# Altium schematic sheet ADC_Power_supply.SchDoc: title
size A2; Author: M.Beldyga; CompanyName: WUT ISE; DrawnBy: M.Beldyga; Organization: WUT ISE; Address1: PW ISE; Address2: Nowowiejska 15/19 00-665 Warsaw; Address3: micbeldyga@gmail.com; SheetNumber: 7; SheetTotal: 8; ModifiedBy: -; CheckedDate: -; Title2: xxx; DivGrp: WUT ISE; Designer: M.Beldyga; ModifiedDate: -; ProjectName: Sensor Box
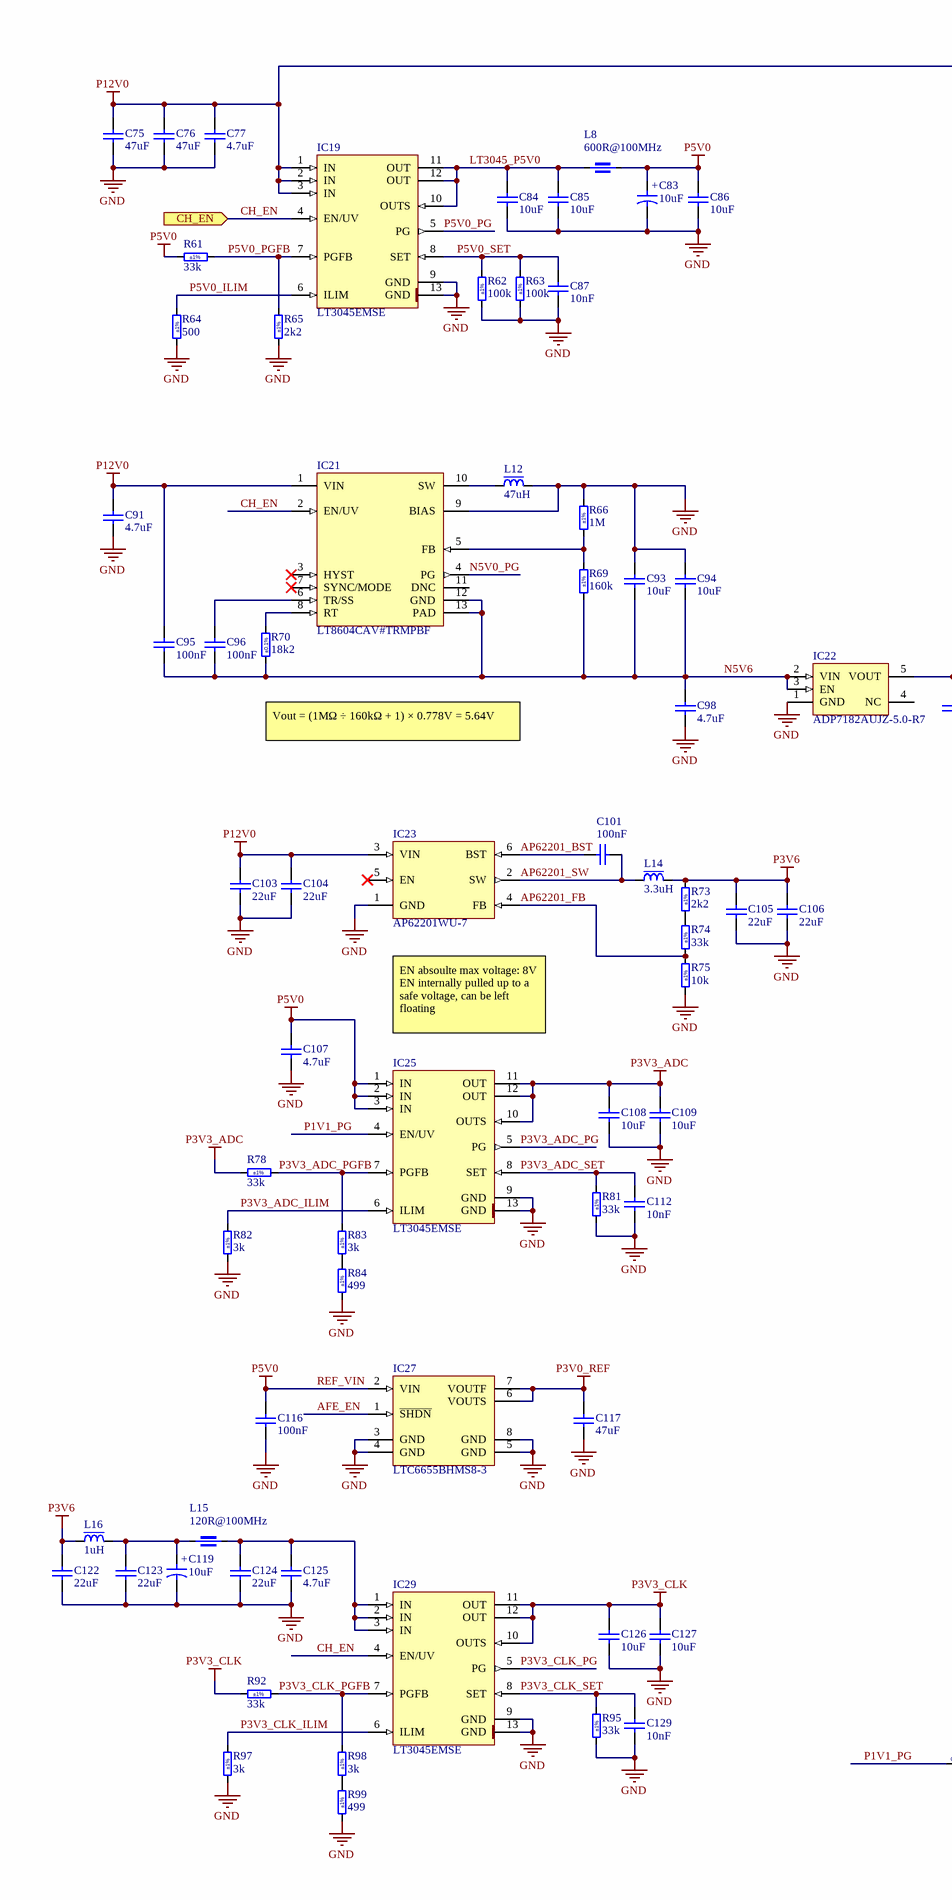
[diagram p0: ADC_Power_supply.SchDoc, left]
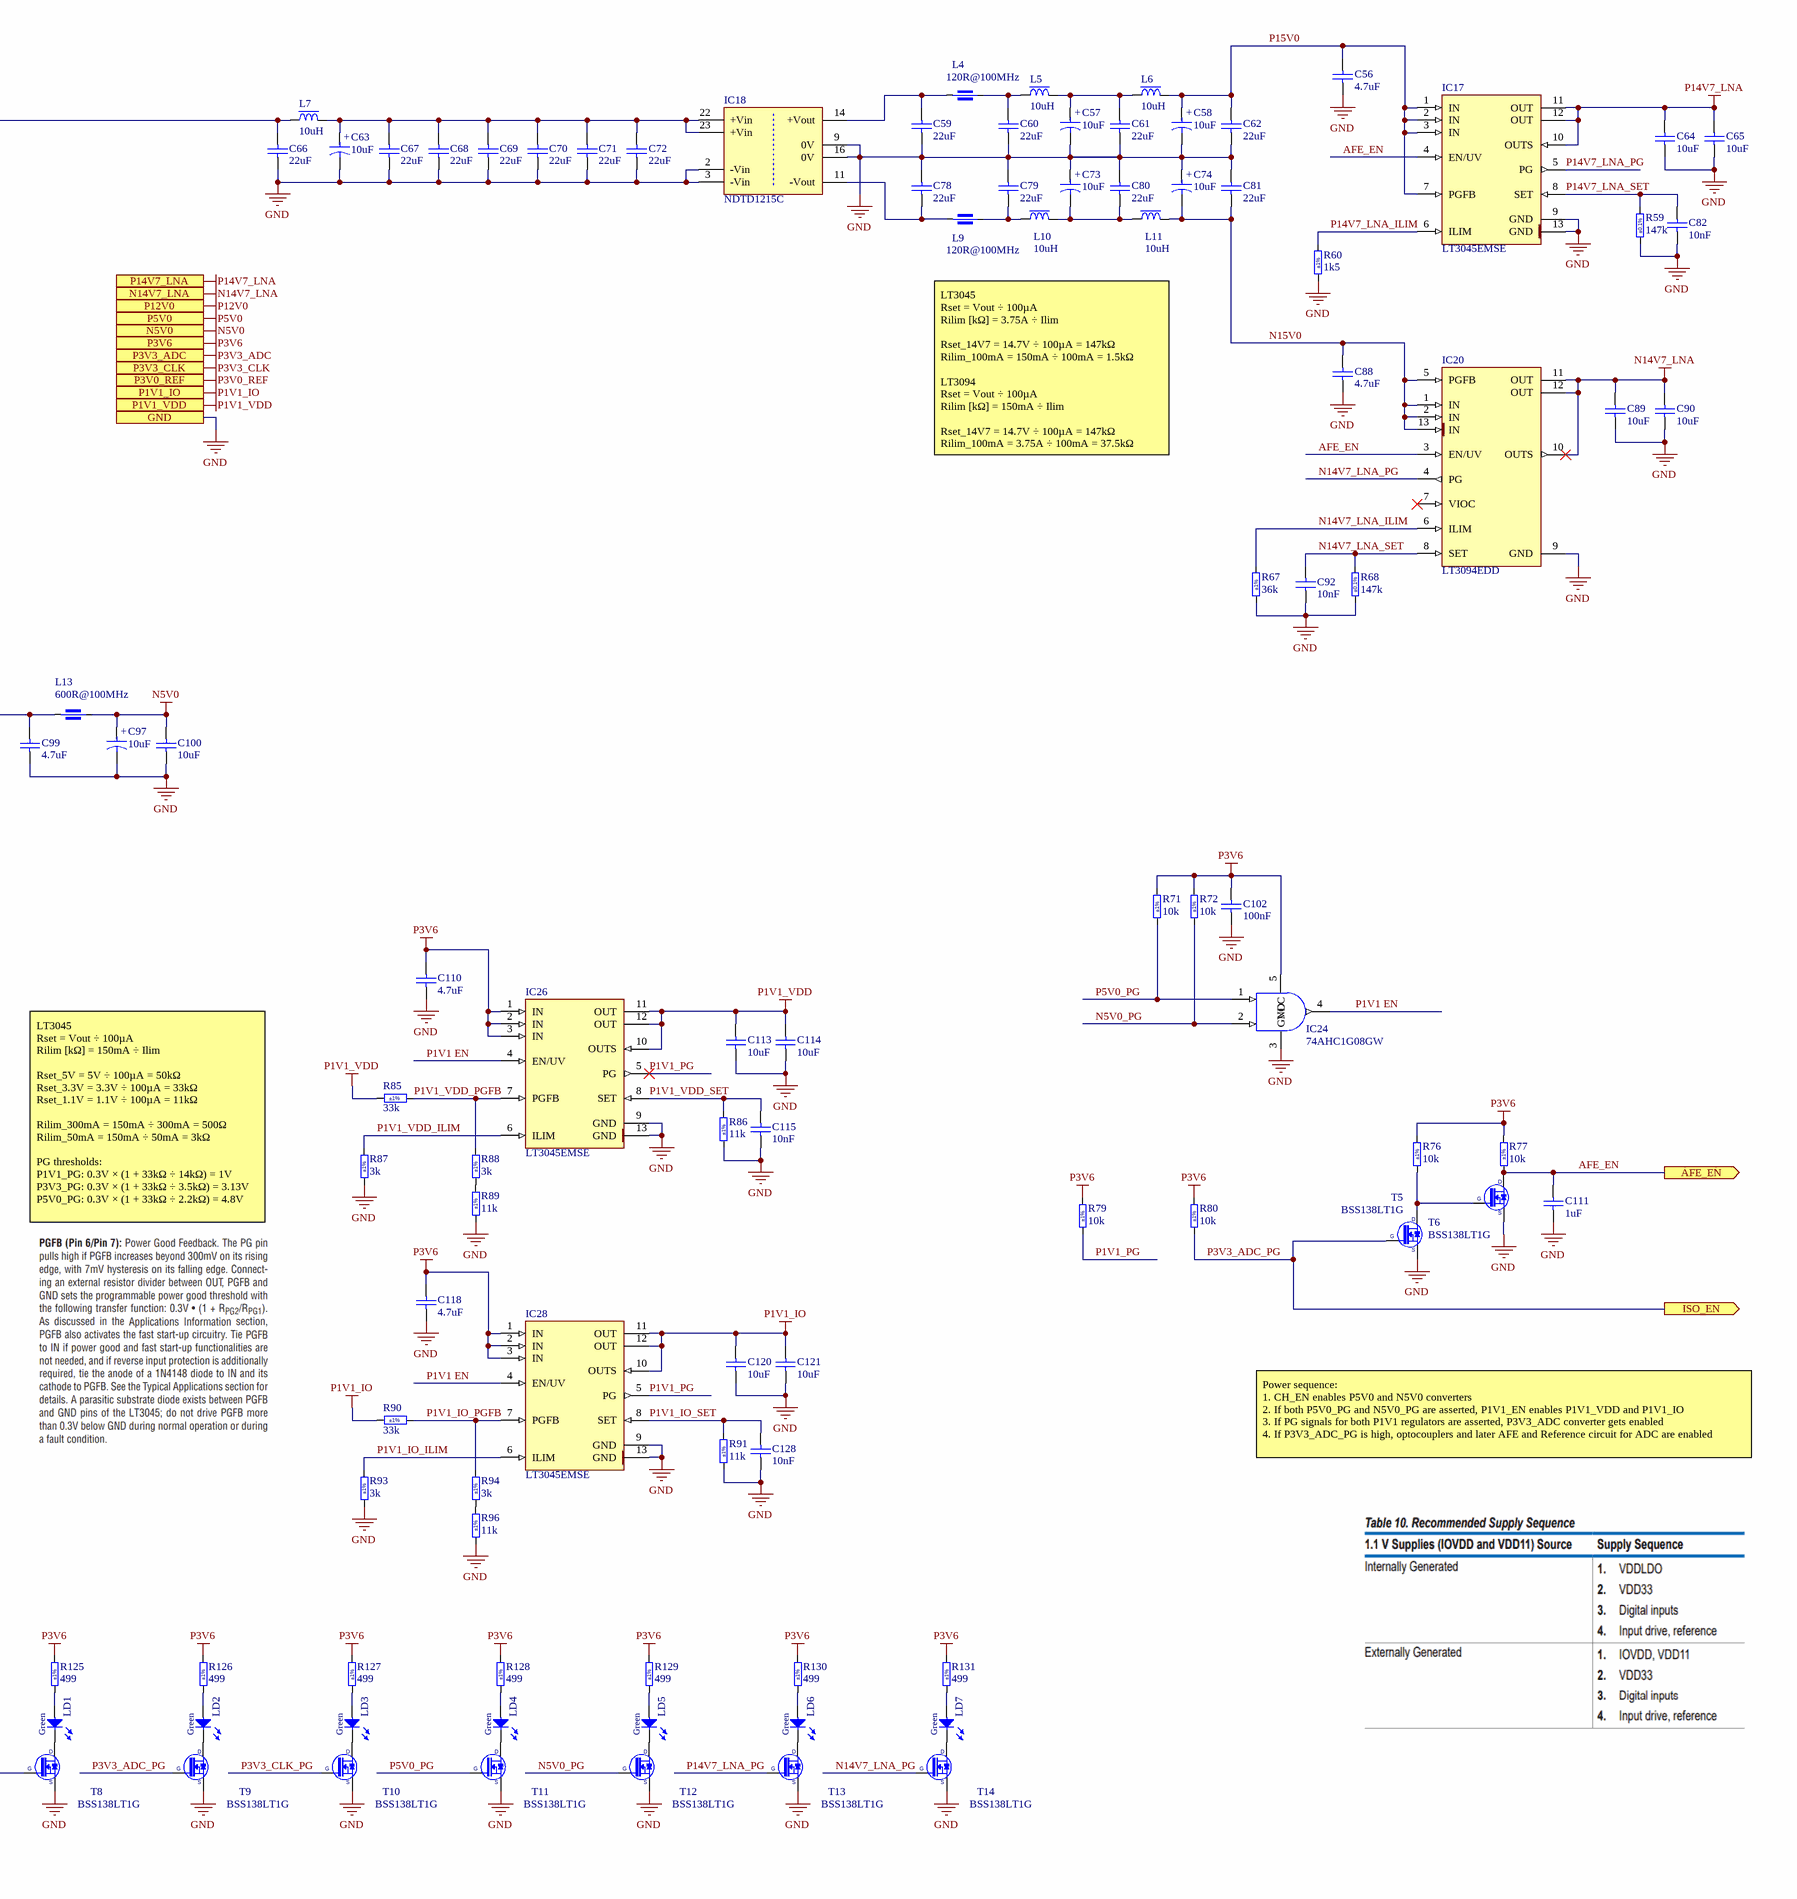
[diagram p1: ADC_Power_supply.SchDoc, right]

## Parts
C56  4.7uF  [CAPC1608X90N]
C57  10uF  [CAPMP3216X180N]
C58  10uF  [CAPMP3216X180N]
C59  22uF  [CAPC2012X135N]
C60  22uF  [CAPC2012X135N]
C61  22uF  [CAPC2012X135N]
C62  22uF  [CAPC2012X135N]
C63  10uF  [CAPMP3216X180N]
C64  10uF  [CAPC2012X95N]
C65  10uF  [CAPC2012X95N]
C66  22uF  [CAPC2012X135N]
C67  22uF  [CAPC2012X135N]
C68  22uF  [CAPC2012X135N]
C69  22uF  [CAPC2012X135N]
C70  22uF  [CAPC2012X135N]
C71  22uF  [CAPC2012X135N]
C72  22uF  [CAPC2012X135N]
C73  10uF  [CAPMP3216X180N]
C74  10uF  [CAPMP3216X180N]
C75  47uF  [CAPC3216X180N]
C76  47uF  [CAPC3216X180N]
C77  4.7uF  [CAPC1608X90N]
C78  22uF  [CAPC2012X135N]
C79  22uF  [CAPC2012X135N]
C80  22uF  [CAPC2012X135N]
C81  22uF  [CAPC2012X135N]
C82  10nF  [CAPC1005X55N]
C83  10uF  [CAPMP3216X180N]
C84  10uF  [CAPC2012X95N]
C85  10uF  [CAPC2012X95N]
C86  10uF  [CAPC2012X95N]
C87  10nF  [CAPC1005X55N]
C88  4.7uF  [CAPC1608X90N]
C89  10uF  [CAPC2012X95N]
C90  10uF  [CAPC2012X95N]
C91  4.7uF  [CAPC1608X90N]
C92  10nF  [CAPC1005X55N]
C93  10uF  [CAPC2012X95N]
C94  10uF  [CAPC2012X95N]
C95  100nF  [CAPC1005X55N]
C96  100nF  [CAPC1005X55N]
C97  10uF  [CAPMP3216X180N]
C98  4.7uF  [CAPC1608X90N]
C99  4.7uF  [CAPC1608X90N]
C100  10uF  [CAPC2012X95N]
C101  100nF  [CAPC1005X55N]
C102  100nF  [CAPC1005X55N]
C103  22uF  [CAPC2012X135N]
C104  22uF  [CAPC2012X135N]
C105  22uF  [CAPC2012X135N]
C106  22uF  [CAPC2012X135N]
C107  4.7uF  [CAPC1608X90N]
C108  10uF  [CAPC2012X95N]
C109  10uF  [CAPC2012X95N]
C110  4.7uF  [CAPC1608X90N]
C111  1uF  [CAPC1608X87N]
C112  10nF  [CAPC1005X55N]
C113  10uF  [CAPC2012X95N]
C114  10uF  [CAPC2012X95N]
C115  10nF  [CAPC1005X55N]
C116  100nF  [CAPC1005X55N]
C117  47uF  [CAPC2012X140N]
C118  4.7uF  [CAPC1608X90N]
C119  10uF  [CAPMP3216X180N]
C120  10uF  [CAPC2012X95N]
C121  10uF  [CAPC2012X95N]
C122  22uF  [CAPC2012X135N]
C123  22uF  [CAPC2012X135N]
C124  22uF  [CAPC2012X135N]
C125  4.7uF  [CAPC1608X90N]
C126  10uF  [CAPC2012X95N]
C127  10uF  [CAPC2012X95N]
C128  10nF  [CAPC1005X55N]
C129  10nF  [CAPC1005X55N]
IC17  LT3045EMSE  [SOP65P490X110-13N-R175X294]
IC18  NDTD1215C  [DCDC_MURATA_NDTD]
IC19  LT3045EMSE  [SOP65P490X110-13N-R175X294]
IC20  LT3094EDD  [SON45P300X300X80-13N-R175X248]
IC21  LT8604CAV#TRMPBF  [QFN50P200X200X83_HS-13N]
IC22  ADP7182AUJZ-5.0-R7  [SOT95P280X90-5N]
IC23  AP62201WU-7  [SOT95P280X100-6N]
IC24  74AHC1G08GW  [SOT65P212X110-5N]
IC25  LT3045EMSE  [SOP65P490X110-13N-R175X294]
IC26  LT3045EMSE  [SOP65P490X110-13N-R175X294]
IC27  LTC6655BHMS8-3  [SOP65P490X110-8N]
IC28  LT3045EMSE  [SOP65P490X110-13N-R175X294]
IC29  LT3045EMSE  [SOP65P490X110-13N-R175X294]
L4  120R@100MHz  [INDC1608X95N]
L5  10uH  [IND_MURATA-PS_8400]
L6  10uH  [IND_MURATA-PS_8400]
L7  10uH  [IND_MURATA-PS_8400]
L8  600R@100MHz  [INDC1608X95N]
L9  120R@100MHz  [INDC1608X95N]
L10  10uH  [IND_MURATA-PS_8400]
L11  10uH  [IND_MURATA-PS_8400]
L12  47uH  [IND_NIC_NPIS64D]
L13  600R@100MHz  [INDC1608X95N]
L14  3.3uH  [IND_WURTH_WE-TPC_4828]
L15  120R@100MHz  [INDC1608X65N]
L16  1uH  [IND_COILCRAFT_PFL3215]
LD1  Green  [LED_AVAGO_HSME-C120]
LD2  Green  [LED_AVAGO_HSME-C120]
LD3  Green  [LED_AVAGO_HSME-C120]
LD4  Green  [LED_AVAGO_HSME-C120]
LD5  Green  [LED_AVAGO_HSME-C120]
LD6  Green  [LED_AVAGO_HSME-C120]
LD7  Green  [LED_AVAGO_HSME-C120]
R59  147k  Tolerance: ±0.1%  [RESC1608X55N]
R60  1k5  Tolerance: ±1%  [RESC1005X40N]
R61  33k  Tolerance: ±1%  [RESC1005X40N]
R62  100k  Tolerance: ±1%  [RESC1005X40N]
R63  100k  Tolerance: ±1%  [RESC1005X40N]
R64  500  Tolerance: ±1%  [RESC1608X55N]
R65  2k2  Tolerance: ±1%  [RESC1005X40N]
R66  1M  Tolerance: ±1%  [RESC1005X40N]
R67  36k  Tolerance: ±1%  [RESC1005X40N]
R68  147k  Tolerance: ±0.1%  [RESC1608X55N]
R69  160k  Tolerance: ±1%  [RESC1005X40N]
R70  18k2  Tolerance: ±0.1%  [RESC1608X55N]
R71  10k  Tolerance: ±1%  [RESC1005X40N]
R72  10k  Tolerance: ±1%  [RESC1005X40N]
R73  2k2  Tolerance: ±1%  [RESC1005X40N]
R74  33k  Tolerance: ±1%  [RESC1005X40N]
R75  10k  Tolerance: ±1%  [RESC1005X40N]
R76  10k  Tolerance: ±1%  [RESC1005X40N]
R77  10k  Tolerance: ±1%  [RESC1005X40N]
R78  33k  Tolerance: ±1%  [RESC1005X40N]
R79  10k  Tolerance: ±1%  [RESC1005X40N]
R80  10k  Tolerance: ±1%  [RESC1005X40N]
R81  33k  Tolerance: ±1%  [RESC1005X40N]
R82  3k  Tolerance: ±1%  [RESC1005X40N]
R83  3k  Tolerance: ±1%  [RESC1005X40N]
R84  499  Tolerance: ±1%  [RESC1005X40N]
R85  33k  Tolerance: ±1%  [RESC1005X40N]
R86  11k  Tolerance: ±1%  [RESC1005X40N]
R87  3k  Tolerance: ±1%  [RESC1005X40N]
R88  3k  Tolerance: ±1%  [RESC1005X40N]
R89  11k  Tolerance: ±1%  [RESC1005X40N]
R90  33k  Tolerance: ±1%  [RESC1005X40N]
R91  11k  Tolerance: ±1%  [RESC1005X40N]
R92  33k  Tolerance: ±1%  [RESC1005X40N]
R93  3k  Tolerance: ±1%  [RESC1005X40N]
R94  3k  Tolerance: ±1%  [RESC1005X40N]
R95  33k  Tolerance: ±1%  [RESC1005X40N]
R96  11k  Tolerance: ±1%  [RESC1005X40N]
R97  3k  Tolerance: ±1%  [RESC1005X40N]
R98  3k  Tolerance: ±1%  [RESC1005X40N]
R99  499  Tolerance: ±1%  [RESC1005X40N]
R125  499  Tolerance: ±1%  [RESC1005X40N]
R126  499  Tolerance: ±1%  [RESC1005X40N]
R127  499  Tolerance: ±1%  [RESC1005X40N]
R128  499  Tolerance: ±1%  [RESC1005X40N]
R129  499  Tolerance: ±1%  [RESC1005X40N]
R130  499  Tolerance: ±1%  [RESC1005X40N]
R131  499  Tolerance: ±1%  [RESC1005X40N]
T5  BSS138LT1G  [SOT95P240X110-3N]
T6  BSS138LT1G  [SOT95P240X110-3N]
T8  BSS138LT1G  [SOT95P240X110-3N]
T9  BSS138LT1G  [SOT95P240X110-3N]
T10  BSS138LT1G  [SOT95P240X110-3N]
T11  BSS138LT1G  [SOT95P240X110-3N]
T12  BSS138LT1G  [SOT95P240X110-3N]
T13  BSS138LT1G  [SOT95P240X110-3N]
T14  BSS138LT1G  [SOT95P240X110-3N]

## Ports
AFE_EN (out), CH_EN (in), GND, ISO_EN (out), N5V0, N14V7_LNA, P1V1_IO, P1V1_VDD, P3V0_REF, P3V3_ADC, P3V3_CLK, P3V6, P5V0, P12V0, P14V7_LNA

## Nets
GND: C56.1 C57.2 C58.2 C59.1 C60.1 C61.1 C62.1 C63.2 C64.1 C65.1 C66.1 C67.1 C68.1 C69.1 C70.1 C71.1 C72.1 C73.1 C74.1 C75.1 C76.1 C77.1 C78.2 C79.2 C80.2 C81.2 C82.1 C83.2 C84.1 C85.1 C86.1 C87.1 C88.1 C89.1 C90.1 C91.1 C92.1 C93.2 C94.2 C97.2 C98.1 C99.1 C100.1 C102.1 C103.1 C104.1 C105.1 C106.1 C107.1 C108.1 C109.1 C110.1 C111.1 C112.1 C113.1 C114.1 C115.1 C116.1 C117.1 C118.1 C119.2 C120.1 C121.1 C122.1 C123.1 C124.1 C125.1 C126.1 C127.1 C128.1 C129.1 IC17.9(GND) IC17.13(GND) IC18.2(-Vin) IC18.3(-Vin) IC18.9(0V) IC18.16(0V) IC19.9(GND) IC19.13(GND) IC20.9(GND) IC21.9(BIAS) IC22.1(GND) IC23.1(GND) IC24.3(GND) IC25.9(GND) IC25.13(GND) IC26.9(GND) IC26.13(GND) IC27.3(GND) IC27.4(GND) IC27.5(GND) IC27.8(GND) IC28.9(GND) IC28.13(GND) IC29.9(GND) IC29.13(GND) L12.2 R59.1 R60.1 R62.1 R63.1 R64.1 R65.1 R66.2 R67.1 R68.1 R75.1 R81.1 R82.1 R84.1 R86.1 R87.1 R89.1 R91.1 R93.1 R95.1 R96.1 R97.1 R99.1 T5.2(S) T6.2(S) T8.2(S) T9.2(S) T10.2(S) T11.2(S) T12.2(S) T13.2(S) T14.2(S) ; port GND
N5V0: C97.1 C100.2 L13.2 ; port N5V0
N14V7_LNA: C89.2 C90.2 IC20.10(OUTS) IC20.11(OUT) IC20.12(OUT) ; port N14V7_LNA
P1V1_IO: C120.2 C121.2 IC28.10(OUTS) IC28.11(OUT) IC28.12(OUT) R90.2 ; port P1V1_IO
P1V1_VDD: C113.2 C114.2 IC26.10(OUTS) IC26.11(OUT) IC26.12(OUT) R85.2 ; port P1V1_VDD
P3V0_REF: C117.2 IC27.6(VOUTS) IC27.7(VOUTF) ; port P3V0_REF
P3V3_ADC: C108.2 C109.2 IC25.10(OUTS) IC25.11(OUT) IC25.12(OUT) R78.2 ; port P3V3_ADC
P3V3_CLK: C126.2 C127.2 IC29.10(OUTS) IC29.11(OUT) IC29.12(OUT) R92.2 ; port P3V3_CLK
P3V6: C102.2 C105.2 C106.2 C110.2 C118.2 C122.2 IC24.5(VCC) IC26.1(IN) IC26.2(IN) IC26.3(IN) IC28.1(IN) IC28.2(IN) IC28.3(IN) L14.2 L16.1 R71.2 R72.2 R73.2 R76.2 R77.2 R79.2 R80.2 R125.2 R126.2 R127.2 R128.2 R129.2 R130.2 R131.2 ; port P3V6
P12V0: C66.2 C75.2 C76.2 C77.2 C91.2 C95.2 C103.2 C104.2 IC19.1(IN) IC19.2(IN) IC19.3(IN) IC21.1(VIN) IC23.3(VIN) L7.1 ; port P12V0
P14V7_LNA: C64.2 C65.2 IC17.10(OUTS) IC17.11(OUT) IC17.12(OUT) ; port P14V7_LNA
REF_VIN: C83.1 C86.2 C107.2 C116.2 IC25.1(IN) IC25.2(IN) IC25.3(IN) IC27.2(VIN) L8.2 R61.2 ; port P5V0  [also labelled P5V0]
AFE_EN: C111.2 IC17.4(EN/UV) IC20.3(EN/UV) IC27.1(~{SHDN}) R77.1 T6.3(D) ; port AFE_EN
AP62201_BST: C101.1 IC23.6(BST)
AP62201_FB: IC23.4(FB) R74.1 R75.2
AP62201_SW: C101.2 IC23.2(SW) L14.1
CH_EN: IC19.4(EN/UV) IC21.2(EN/UV) IC29.4(EN/UV) ; port CH_EN
LT3045_P5V0: C84.2 C85.2 IC19.10(OUTS) IC19.11(OUT) IC19.12(OUT) L8.1
N5V0_PG: IC21.4(PG) IC24.2(B) R72.1 T12.1(G)
N5V6: C93.1 C94.1 C95.1 C96.1 C98.2 IC21.12(GND) IC21.13(PAD) IC22.2(VIN) IC22.3(EN) R69.1 R70.1
N14V7_LNA_ILIM: IC20.6(ILIM) R67.2
N14V7_LNA_PG: IC20.4(PG) T14.1(G)
N14V7_LNA_SET: C92.2 IC20.8(SET) R68.2
N15V0: C74.2 C81.1 C88.2 IC20.1(IN) IC20.2(IN) IC20.5(PGFB) IC20.13(IN) L11.2
P1V1 EN: IC24.4(Y) IC26.4(EN/UV) IC28.4(EN/UV)
P1V1_IO_ILIM: IC28.6(ILIM) R93.2
P1V1_IO_PGFB: IC28.7(PGFB) R90.1 R94.2
P1V1_IO_SET: C128.2 IC28.8(SET) R91.2
P1V1_PG: IC25.4(EN/UV) IC26.5(PG) IC28.5(PG) R79.1 T8.1(G)
P1V1_VDD_ILIM: IC26.6(ILIM) R87.2
P1V1_VDD_PGFB: IC26.7(PGFB) R85.1 R88.2
P1V1_VDD_SET: C115.2 IC26.8(SET) R86.2
P3V3_ADC_ILIM: IC25.6(ILIM) R82.2
P3V3_ADC_PG: IC25.5(PG) R80.1 T5.1(G) T9.1(G) ; port ISO_EN
P3V3_ADC_PGFB: IC25.7(PGFB) R78.1 R83.2
P3V3_ADC_SET: C112.2 IC25.8(SET) R81.2
P3V3_CLK_ILIM: IC29.6(ILIM) R97.2
P3V3_CLK_PG: IC29.5(PG) T10.1(G)
P3V3_CLK_PGFB: IC29.7(PGFB) R92.1 R98.2
P3V3_CLK_SET: C129.2 IC29.8(SET) R95.2
P5V0_ILIM: IC19.6(ILIM) R64.2
P5V0_PG: IC19.5(PG) IC24.1(A) R71.1 T11.1(G)
P5V0_PGFB: IC19.7(PGFB) R61.1 R65.2
P5V0_SET: C87.2 IC19.8(SET) R62.2 R63.2
P14V7_LNA_ILIM: IC17.6(ILIM) R60.2
P14V7_LNA_PG: IC17.5(PG) T13.1(G)
P14V7_LNA_SET: C82.2 IC17.8(SET) R59.2
P15V0: C56.2 C58.1 C62.2 IC17.1(IN) IC17.2(IN) IC17.3(IN) IC17.7(PGFB) L6.2
NetC57_1: C57.1 C61.2 L5.2 L6.1
NetC59_2: C59.2 IC18.14(+Vout) L4.1
NetC60_2: C60.2 L4.2 L5.1
NetC63_1: C63.1 C67.2 C68.2 C69.2 C70.2 C71.2 C72.2 IC18.22(+Vin) IC18.23(+Vin) L7.2
NetC73_2: C73.2 C80.1 L10.2 L11.1
NetC78_1: C78.1 IC18.11(-Vout) L9.1
NetC79_1: C79.1 L9.2 L10.1
NetC96_2: C96.2 IC21.6(TR/SS)
NetC99_2: C99.2 IC22.5(VOUT) L13.1
NetC119_1: C119.1 C123.2 L15.1 L16.2
NetC124_2: C124.2 C125.2 IC29.1(IN) IC29.2(IN) IC29.3(IN) L15.2
NetIC21_5: IC21.5(FB) R66.1 R69.2
NetIC21_8: IC21.8(RT) R70.2
NetIC21_10: IC21.10(SW) L12.1
NetLD1_1: LD1.1(C) T8.3(D)
NetLD1_2: LD1.2(A) R125.1
NetLD2_1: LD2.1(C) T9.3(D)
NetLD2_2: LD2.2(A) R126.1
NetLD3_1: LD3.1(C) T10.3(D)
NetLD3_2: LD3.2(A) R127.1
NetLD4_1: LD4.1(C) T11.3(D)
NetLD4_2: LD4.2(A) R128.1
NetLD5_1: LD5.1(C) T12.3(D)
NetLD5_2: LD5.2(A) R129.1
NetLD6_1: LD6.1(C) T13.3(D)
NetLD6_2: LD6.2(A) R130.1
NetLD7_1: LD7.1(C) T14.3(D)
NetLD7_2: LD7.2(A) R131.1
NetR73_1: R73.1 R74.2
NetR76_1: R76.1 T5.3(D) T6.1(G)
NetR83_1: R83.1 R84.2
NetR88_1: R88.1 R89.2
NetR94_1: R94.1 R96.2
NetR98_1: R98.1 R99.2

Not connected (* = marked no-connect by the designer): IC20 7(VIOC)*; IC21 3(HYST)* 7(SYNC/MODE)* 11(DNC); IC22 4(NC); IC23 5(EN)*

## Notes on the sheet
- LT3045
  Rset = Vout ÷ 100µA
  Rilim [kΩ] = 3.75A ÷ Ilim
  Rset_14V7 = 14.7V ÷ 100µA = 147kΩ
  Rilim_100mA = 150mA ÷ 100mA = 1.5kΩ
  LT3094
  Rset = Vout ÷ 100µA
  Rilim [kΩ] = 150mA ÷ Ilim
  Rset_14V7 = 14.7V ÷ 100µA = 147kΩ
  Rilim_100mA = 3.75A ÷ 100mA = 37.5kΩ
- Vout = (1MΩ ÷ 160kΩ + 1) × 0.778V = 5.64V
- EN absoulte max voltage: 8V
  EN internally pulled up to a safe voltage, can be left floating
- LT3045
  Rset = Vout ÷ 100µA
  Rilim [kΩ] = 150mA ÷ Ilim
  Rset_5V = 5V ÷ 100µA = 50kΩ
  Rset_3.3V = 3.3V ÷ 100µA = 33kΩ
  Rset_1.1V = 1.1V ÷ 100µA = 11kΩ
  Rilim_300mA = 150mA ÷ 300mA = 500Ω
  Rilim_50mA = 150mA ÷ 50mA = 3kΩ
  PG thresholds:
  P1V1_PG: 0.3V × (1 + 33kΩ ÷ 14kΩ) = 1V
  P3V3_PG: 0.3V × (1 + 33kΩ ÷ 3.5kΩ) = 3.13V
  P5V0_PG: 0.3V × (1 + 33kΩ ÷ 2.2kΩ) = 4.8V
- Power sequence:
  1. CH_EN enables P5V0 and N5V0 converters
  2. If both P5V0_PG and N5V0_PG are asserted, P1V1_EN enables P1V1_VDD and P1V1_IO
  3. If PG signals for both P1V1 regulators are asserted, P3V3_ADC converter gets enabled
  4. If P3V3_ADC_PG is high, optocouplers and later AFE and Reference circuit for ADC are enabled
- Project/Equipment
- Document
- Designer
- Drawn by
- Check.by
- Last Mod.
- Contact
- File
- Print Date
- Sheet
- Size
- A2
- of
- Rev
- (in symbol CTE3216-18_10UF_10V_10%_LESR1800) +
- (in symbol CTE3216-18_10UF_16V_20%_AVX_TCJ) +

## Library data of the parts
C56 C77 C88 C91 C98 C99 C107 C110 C118 C125 = CC0603_4.7UF_25V_10%_X5R: Non-polarised capacitor; Part Description: SMD Multilayer Chip Ceramic Capacitor; Manufacturer: GENERIC; Manufacturer1 Part Number: GRM188R61E475KE11D; Voltage: 25V; TC: X5R; Tolerance: ±10%; Part Number: CC0603_4.7UF_25V_10%_X5R; Component Kind: Standard; Component Type: Standard; Pin Count: 2; Value: 4.7uF; Status: None; Manufacturer Part Number: CC0603_4.7UF_25V_10%_X5R; Case: 0603; Mounted: Yes; Socket: No; SMD: Yes; Sense: No; Manufacturer1 Example: MURATA; Manufacturer1 ComponentHeight: 0.95mm; HelpURL: \\cern.ch\dfs\Applications\Altium\Datasheets\CC0603_MURATA_GRM188R61E475KE11D.pdf; Author: CERN DEM JLC; CreateDate: 11/10/2014; LatestRevisionDate: 11/10/2014
C57 C58 C63 C73 C74 C119 = CTE3216-18_10UF_16V_20%_AVX_TCJ: Polarised capacitor; Part Description: ESR 0R200 Tantalum Solid Electrolytic Chip Capacitor with Conductive Polymer Electrode; Manufacturer: AVX; Manufacturer Part Number: TCJA106M016R0200; Voltage: 16V; Tolerance: ±20%; Part Number: CTE3216-18_10UF_16V_20%_AVX_TCJ; Component Kind: Standard; Component Type: Standard; Pin Count: 2; Value: 10uF; Status: Preferred; Case: A; Mounted: Yes; Socket: No; SMD: Yes; Sense: No; ComponentHeight: 1.8mm; HelpURL: \\cern.ch\dfs\Applications\Altium\Datasheets\CTE_AVX_TCJ.pdf; Author: CERN DEM JLC
  C57 C58 C63 C73 C74: CreateDate: 29.03.2012; LatestRevisionDate: 29.03.2012
  C119: CreateDate: 3/29/2012; LatestRevisionDate: 3/29/2012
C59-C62 C66-C72 C78-C81 C103-C106 C122-C124 = CC0805_22UF_16V_10%_X5R: Non-polarised capacitor; Part Description: SMD Multilayer Chip Ceramic Capacitor; Manufacturer: GENERIC; Manufacturer1 Part Number: C2012X5R1C226KT; Voltage: 16V; TC: X5R; Tolerance: ±10%; Part Number: CC0805_22UF_16V_10%_X5R; Component Kind: Standard; Component Type: Standard; Pin Count: 2; Value: 22uF; Status: Preferred; Manufacturer Part Number: CC0805_22UF_16V_10%_X5R; Case: 0805; Mounted: Yes; Socket: No; SMD: Yes; Sense: No; Manufacturer1 Example: TDK; Manufacturer1 ComponentHeight: 1.35mm; HelpURL: \\cern.ch\dfs\Applications\Altium\Datasheets\CC0805_X5R_TDK_C.pdf; Author: CERN DEM JLC
  C59-C62 C66-C72 C78-C81: CreateDate: 25.10.2012; LatestRevisionDate: 25.10.2012
  C103-C106 C122-C124: CreateDate: 10/25/2012; LatestRevisionDate: 10/25/2012
C64 C65 C84-C86 C89 C90 C93 C94 C100 C108 C109 C113 C114 C120 C121 C126 C127 = CC0805_10UF_25V_10%_X5R: Non-polarised capacitor; Part Description: SMD Multilayer Chip Ceramic Capacitor; Manufacturer: GENERIC; Manufacturer1 Part Number: GRM219R61E106KA12D; Voltage: 25V; TC: X5R; Tolerance: ±10%; Part Number: CC0805_10UF_25V_10%_X5R; Component Kind: Standard; Component Type: Standard; Pin Count: 2; Value: 10uF; Status: Preferred; Manufacturer Part Number: CC0805_10UF_25V_10%_X5R; Case: 0805; Mounted: Yes; Socket: No; SMD: Yes; Sense: No; Manufacturer1 Example: MURATA; Manufacturer1 ComponentHeight: 0.95mm; HelpURL: \\cern.ch\dfs\Applications\Altium\Datasheets\CC0805_X5R_MURATA_GRM.pdf; Author: CERN DEM JLC; CreateDate: 10/25/2012; LatestRevisionDate: 9/6/2016
C75 C76 = CC1206_47UF_25V_20%_X5R: Non-polarised capacitor; Part Description: SMD Multilayer Chip Ceramic Capacitor; Manufacturer: GENERIC; Manufacturer1 Part Number: C3216X5R1E476M160; Voltage: 25V; TC: X5R; Tolerance: ±20%; Part Number: CC1206_47UF_25V_20%_X5R; Component Kind: Standard; Component Type: Standard; Pin Count: 2; Value: 47uF; Status: None; Manufacturer Part Number: CC1206_47UF_25V_20%_X5R; Case: 1206; Mounted: Yes; Socket: No; SMD: Yes; Sense: No; Manufacturer1 Example: TDK; Manufacturer1 ComponentHeight: 1.8mm; HelpURL: \\cern.ch\dfs\Applications\Altium\Datasheets\CC1206_X5R_TDK_C.pdf; Author: CERN DEM JLC; CreateDate: 11/20/2013; LatestRevisionDate: 3/14/2017
C82 C87 C92 C112 C115 C128 C129 = CC0402_10NF_16V_10%_X7R: Non-polarised capacitor; Part Description: SMD Multilayer Chip Ceramic Capacitor; Manufacturer: GENERIC; Manufacturer1 Part Number: 223878715636; Voltage: 16V; TC: X7R; Tolerance: ±10%; Part Number: CC0402_10NF_16V_10%_X7R; Component Kind: Standard; Component Type: Standard; Pin Count: 2; Value: 10nF; Status: Not Recommended; Manufacturer Part Number: CC0402_10NF_16V_10%_X7R; Case: 0402; Mounted: Yes; Socket: No; SMD: Yes; Sense: No; Manufacturer1 Example: PHYCOMP; Manufacturer1 ComponentHeight: 0.55mm; HelpURL: \\cern.ch\dfs\Applications\Altium\Datasheets\CC0402_X7R_PHYCOMP.pdf; Author: CERN DEM JLC; CreateDate: 12/3/2007; LatestRevisionDate: 12/3/2007
C83 C97 = CTE3216-18_10UF_10V_10%_LESR1800: Polarised capacitor; Part Description: Low ESR 1R8 Solid Tantalum Chip Capacitor; Manufacturer: GENERIC; Manufacturer1 Part Number: TPSA106K010R1800; Voltage: 10V; Tolerance: ±10%; Part Number: CTE3216-18_10UF_10V_10%_LESR1800; Component Kind: Standard; Component Type: Standard; Pin Count: 2; Value: 10uF; Status: Preferred; Manufacturer Part Number: CTE3216-18_10UF_10V_10%_LESR1800; Case: A; Mounted: Yes; Socket: No; SMD: Yes; Sense: No; Manufacturer1 Example: AVX; Manufacturer1 ComponentHeight: 1.8mm; HelpURL: \\cern.ch\dfs\Applications\Altium\Datasheets\CTE-LESR_AVX_TPS.pdf; Author: CERN DEM JLC; CreateDate: 5/5/2008; LatestRevisionDate: 1/20/2009
C95 C96 C116 = CC0402_100NF_50V_10%_X7R: Non-polarised capacitor; Part Description: SMD Multilayer Chip Ceramic Capacitor; Manufacturer: GENERIC; Manufacturer1 Part Number: GRM155R71H104KE14D; Voltage: 50V; TC: X7R; Tolerance: ±10%; Part Number: CC0402_100NF_50V_10%_X7R; Component Kind: Standard; Component Type: Standard; Pin Count: 2; Value: 100nF; Status: None; Manufacturer Part Number: CC0402_100NF_50V_10%_X7R; Case: 0402; Mounted: Yes; Socket: No; SMD: Yes; Sense: No; Manufacturer1 Example: MURATA; Manufacturer1 ComponentHeight: 0.55mm; HelpURL: \\cern.ch\dfs\Applications\Altium\Datasheets\CC0402_MURATA_GRM155R71H104KE14D.pdf; Author: CERN DEM MR; CreateDate: 6/30/2017; LatestRevisionDate: 6/30/2017
C101 C102 = CC0402_100NF_16V_10%_X7R: Non-polarised capacitor; Part Description: SMD Multilayer Chip Ceramic Capacitor; Manufacturer: GENERIC; Manufacturer1 Part Number: GRM155R71C104KA88D; Voltage: 16V; TC: X7R; Tolerance: ±10%; Part Number: CC0402_100NF_16V_10%_X7R; Component Kind: Standard; Component Type: Standard; Pin Count: 2; Value: 100nF; Status: Not Recommended; Manufacturer Part Number: CC0402_100NF_16V_10%_X7R; Case: 0402; Mounted: Yes; Socket: No; SMD: Yes; Sense: No; Manufacturer1 Example: MURATA; Manufacturer1 ComponentHeight: 0.55mm; HelpURL: \\cern.ch\dfs\Applications\Altium\Datasheets\CC0402_X7R_MURATA_GRM.pdf; Author: CERN DEM JLC; CreateDate: 12/5/2013; LatestRevisionDate: 12/3/2007
C111 = CC0603_1UF_25V_10%_X7R: Non-polarised capacitor; Part Description: SMD Multilayer Chip Ceramic Capacitor; Manufacturer: GENERIC; Manufacturer1 Part Number: GRM188R71E105KA12D; Voltage: 25V; TC: X7R; Tolerance: ±10%; Part Number: CC0603_1UF_25V_10%_X7R; Component Kind: Standard; Component Type: Standard; Pin Count: 2; Value: 1uF; Status: None; Manufacturer Part Number: CC0603_1UF_25V_10%_X7R; Case: 0603; Mounted: Yes; Socket: No; SMD: Yes; Sense: No; Manufacturer1 Example: MURATA; Manufacturer1 ComponentHeight: 0.9mm; HelpURL: \\cern.ch\dfs\Applications\Altium\Datasheets\CC0603_X7R_MURATA.pdf; Author: CERN DEM JLC; CreateDate: 1/18/2011; LatestRevisionDate: 1/18/2011
C117 = CC0805_47UF_6.3V_10%_X5R: Non-polarised capacitor; Part Description: SMD Multilayer Chip Ceramic Capacitor; Manufacturer: GENERIC; Manufacturer1 Part Number: C0805C476K9PAC; Voltage: 6.3V; TC: X5R; Tolerance: ±10%; Part Number: CC0805_47UF_6.3V_10%_X5R; Component Kind: Standard; Component Type: Standard; Pin Count: 2; Value: 47uF; Status: Preferred; Manufacturer Part Number: CC0805_47UF_6.3V_10%_X5R; Case: 0805; Mounted: Yes; Socket: No; SMD: Yes; Sense: No; Manufacturer1 Example: KEMET; Manufacturer1 ComponentHeight: 1.4mm; HelpURL: \\cern.ch\dfs\Applications\Altium\Datasheets\CC0805_X5R_KEMET.pdf; Author: CERN DEM HF; CreateDate: 7/10/2023; LatestRevisionDate: 7/10/2023
IC17 IC19 IC25 IC26 IC28 IC29 = LT3045EMSE: 20V, 500mA, Ultralow Noise, Ultrahigh PSRR Linear Regulator; Manufacturer: LINEAR TECHNOLOGY; PressFit: No; Bonding: No; Part Number: LT3045EMSE; Component Kind: Standard; Component Type: Standard; Device: LT3045EMSE; PackageDescription: SOP, 0.65mm Pitch; 12 Pin, 3.00mm W X 4.039mm L X 1.10mm H body (w/Thermal Tab 1.75 X 2.94 mm), IPC Medium Density; Part Description: 20V, 500mA, Ultralow Noise, Ultrahigh PSRR Linear Regulator; Manufacturer Part Number: LT3045EMSE; Pin Count: 13; Case: MSOP12; Mounted: Yes; Socket: No; SMD: Yes; Sense: No; ComponentHeight: 1.1mm; HelpURL: \\cern.ch\dfs\Applications\Altium\Datasheets\LT3045.pdf; Author: CERN DEM HF; CreateDate: 5/18/2022; LatestRevisionDate: 5/18/2022
IC18 = NDTD1215C: Isolated 3W Wide Input Dual Output DC-DC Converters; Part Description: 12V to ±15V, Isolated 3W Wide Input Dual Output DC-DC Converters; Manufacturer: MURATA POWER SOLUTIONS; PressFit: No; Bonding: No; Part Number: NDTD1215C; Component Kind: Standard; Component Type: Standard; Device: NDTD1215C; PackageDescription: NDTD Series, 8-Leads, Body 32.26x14.66mm (max), Pitch 2.54mm; Manufacturer Part Number: NDTD1215C; Pin Count: 8; Mounted: Yes; Socket: No; SMD: No; Sense: No; ComponentHeight: 7mm; HelpURL: \\cern.ch\dfs\Applications\Altium\Datasheets\NDTD.pdf; Author: CERN DEM HF; CreateDate: 6/3/2024; LatestRevisionDate: 6/3/2024
IC20 = LT3094EDD#PBF: -20V, 500mA, Ultralow Noise, Ultrahigh PSRR Negative Linear Regulator; Manufacturer: LINEAR TECHNOLOGY; PressFit: No; Bonding: No; Part Number: LT3094EDD#PBF; Component Kind: Standard; Component Type: Standard; Device: LT3094EDD; PackageDescription: SON, 0.45mm Pitch; 12 Pin, 3.00mm W X 3.00mm L X 0.80mm H body (w/Thermal Tab 1.75 X 2.48mm), IPC Medium Density; Part Description: -20V, 500mA, Ultralow Noise, Ultrahigh PSRR Negative Linear Regulator; Manufacturer Part Number: LT3094EDD; Pin Count: 13; Case: SON12; Mounted: Yes; Socket: No; SMD: Yes; Sense: No; ComponentHeight: 0.8mm; HelpURL: \\cern.ch\dfs\Applications\Altium\Datasheets\LT3094EDD#PBF.pdf; Author: CERN DEM JLC; CreateDate: 11/12/2018; LatestRevisionDate: 2/3/2022
IC21 = LT8604CAV#TRMPBF: High Efficiency 42V/120mA Synchronous Buck; Manufacturer: Analog Devices; Part Number: LT8604CAV#TRMPBF; Component Kind: Standard; Component Type: Standard; Device: LT8604CAV#TRMPBF; PackageDescription: QFN, 12-Leads, Body 2.00x2.00mm, Pitch 0.50mm, Thermal Pad 0.70x0.70mm, IPC Medium Density; Part Description: High Efficiency 42V/120mA Synchronous Buck; Manufacturer Part Number: LT8604CAV#TRMPBF; Pin Count: 13; Case: QFN; Status: Active; Author: Michal Beldyga; CreateDate: 2/1/2025; LastRevision: 2/1/2025
IC22 = ADP7182AUJZ-5.0-R7: –5V, 200 mA, Low Noise, Linear Regulator; Part Description: -5V, -200mA, Low Noise, Linear Regulator; Manufacturer: ANALOG DEVICES; PressFit: No; Bonding: No; Part Number: ADP7182AUJZ-5.0-R7; Component Kind: Standard; Component Type: Standard; Device: ADP7182AUJZ-5.0-R7; PackageDescription: SOT23, 0.95mm Pitch; 5 Pin, 1.75mm W X 3.00mm L X 0.90mm H body, IPC Medium Density; Manufacturer Part Number: ADP7182AUJZ-5.0; Pin Count: 5; Case: SOT23-5; Mounted: Yes; Socket: No; SMD: Yes; Sense: No; ComponentHeight: 0.9mm; HelpURL: \\cern.ch\dfs\Applications\Altium\Datasheets\ADP7182AUJZ-5.0-R7.pdf; Author: CERN DEM JLC; CreateDate: 3/17/2014; LatestRevisionDate: 2/15/2024
IC23 = AP62201WU-7: 4.2V TO 18V INPUT, 2A LOW IQ SYNCHRONOUS BUCK CONVERTER; Manufacturer: DIODES INCORPORATED; PressFit: No; Bonding: No; Part Number: AP62201WU-7; Component Kind: Standard; Component Type: Standard; Device: AP62201WU-7; PackageDescription: SOT23, 0.95mm Pitch; 6 Pin, 1.625mm W X 2.90mm L X 1.00mm H body, IPC Medium Density; Part Description: 4.2V To 18V Input, 2A Low Iq Synchronous Buck Converter; Manufacturer Part Number: AP62201WU; Pin Count: 6; Case: SOT23-6; Mounted: Yes; Socket: No; SMD: Yes; Sense: No; ComponentHeight: 1.1mm; HelpURL: \\cern.ch\dfs\Applications\Altium\Datasheets\AP6220x.pdf; Author: CERN DEM HF; CreateDate: 1/7/2022; LatestRevisionDate: 3/21/2022
IC24 = 74AHC1G08GW: Single 2-Input AND Gate; Manufacturer: NXP Semiconductors; Part Number: 74AHC1G08GW; Component Kind: Standard; Component Type: Standard; Device: 74AHC1G08GW; PackageDescription: SOT353, SC70-5, 0.65mm Pitch; 5 Pin, 1.25mm W X 2.05mm L X 1.10mm H body, IPC Medium Density; Part Description: Single 2-Input AND Gate; Manufacturer Part Number: 74AHC1G08GW; Pin Count: 5; Case: SOT23-5; Status: Active; Author: Michal Beldyga; CreateDate: 2/2/2025; LastRevision: 2/2/2025
IC27 = LTC6655BHMS8-3: 0.25ppm Noise, Low Drift Precision Buffered Voltage Reference; Part Description: 3V, 0.25ppm Noise, Low Drift Precision Buffered Voltage Reference; Manufacturer: ANALOG DEVICES; PressFit: No; Bonding: No; Part Number: LTC6655BHMS8-3; Component Kind: Standard; Component Type: Standard; Device: LTC6655BHMS8-3; PackageDescription: SOP, 8-Leads, Body 3.1x3.1mm (max), Pitch 0.65mm, IPC Medium Density; Manufacturer Part Number: LTC6655BHMS8-3; Pin Count: 8; Case: SSOP8; Mounted: Yes; Socket: No; SMD: Yes; Sense: No; ComponentHeight: 1.1mm; HelpURL: \\cern.ch\dfs\Applications\Altium\Datasheets\LTC6655BHMS8-3.pdf; Author: CERN DEM HF; CreateDate: 12/13/2021; LatestRevisionDate: 12/13/2021
L4 L9 = IND0603_MURATA_BLM18PG121SN1D: Part Description: SMD EMIFIL Chip Ferrite Bead; Manufacturer: MURATA; Power: 2A; Resistance: 0.05R; Part Number: IND0603_MURATA_BLM18PG121SN1D; Component Kind: Standard; Component Type: Standard; Pin Count: 2; Value: 120R@100MHz; Manufacturer Part Number: BLM18PG121SN1D; Case: 0603; Mounted: Yes; Socket: No; SMD: Yes; Sense: No; ComponentHeight: 0.95mm; HelpURL: \\cern.ch\dfs\Applications\Altium\Datasheets\IND0603_MURATA_BLM18P.pdf; Author: CERN DEM BC; CreateDate: 27.07.2015; LatestRevisionDate: 25.10.2018
L5-L7 L10 L11 = IND_10UH_10%_MURATA-PS_8400: Inductor With Core; Part Description: Miniature Surface Mount Power Inductor (8400 Serie); Manufacturer: MURATA POWER SOLUTIONS; Manufacturer Part Number: 84103C; Power: 950mA; Resistance: 0.24R; Tolerance: ±10%; Part Number: IND_10UH_10%_MURATA-PS_8400; Component Kind: Standard; Component Type: Standard; Pin Count: 2; Value: 10uH; Status: None; Mounted: Yes; Socket: No; SMD: Yes; Sense: No; ComponentHeight: 2.9mm; HelpURL: \\cern.ch\dfs\Applications\Altium\Datasheets\IND_MURATA-PS_8400.pdf; Author: CERN DEM JLC; CreateDate: 02.07.2012; LatestRevisionDate: 02.07.2012
L8 L13 = IND0603_MURATA_BLM18BD601SN1D: Part Description: SMD EMIFIL Suppression Chip Ferrite Bead; Manufacturer: MURATA; Power: 200mA; Resistance: 0.65R; Tolerance: ±25%; Part Number: IND0603_MURATA_BLM18BD601SN1D; Component Kind: Standard; Component Type: Standard; Pin Count: 2; Value: 600R@100MHz; Manufacturer Part Number: BLM18BD601SN1D; Case: 0603; Mounted: Yes; Socket: No; SMD: Yes; Sense: No; ComponentHeight: 0.95mm; HelpURL: \\cern.ch\dfs\Applications\Altium\Datasheets\IND0603_MURATA_BLM18B.pdf; Author: CERN DEM JLC; CreateDate: 7/4/2012; LatestRevisionDate: 10/25/2018
L12 = IND_47UH_20%_NIC_NPIS64D470MTRF: Inductor With Core; Part Description: SMT Shielded Power Inductor (NPIS__D Series); Manufacturer: NIC COMPONENTS; Power: 950mA; Resistance: 0.155R; Tolerance: ±20%; Part Number: IND_47UH_20%_NIC_NPIS64D470MTRF; Component Kind: Standard; Component Type: Standard; Pin Count: 2; Value: 47uH; Manufacturer Part Number: NPIS64D470MTRF; Mounted: Yes; Socket: No; SMD: Yes; Sense: No; ComponentHeight: 4mm; HelpURL: \\cern.ch\dfs\Applications\Altium\Datasheets\IND_NIC_NPIS64D.pdf; Author: CERN DEM JLC; CreateDate: 6/9/2015; LatestRevisionDate: 10/25/2018
L14 = IND_3.3UH_30%_WURTH_WE-TPC_744043003: Inductor With Core; Part Description: Shielded Tiny Power Inductor (WE-TPC Serie); Manufacturer: WURTH ELEKTRONIK; Power: 2.15A; Resistance: 0.03R; Tolerance: ±30%; Part Number: IND_3.3UH_30%_WURTH_WE-TPC_744043003; Component Kind: Standard; Component Type: Standard; Pin Count: 2; Value: 3.3uH; Manufacturer Part Number: 744043003; Mounted: Yes; Socket: No; SMD: Yes; Sense: No; ComponentHeight: 3mm; HelpURL: \\cern.ch\dfs\Applications\Altium\Datasheets\IND_WURTH_WE-TPC_744043003.pdf; Author: CERN DEM JLC; CreateDate: 7/12/2011; LatestRevisionDate: 1/24/2012
L15 = IND0603_MURATA_BLM18SG121TN1D: Part Description: SMD EMIFIL Suppression Chip Ferrite Bead; Manufacturer: MURATA; Power: 3A; Resistance: 0.025R; Tolerance: ±25%; Part Number: IND0603_MURATA_BLM18SG121TN1D; Component Kind: Standard; Component Type: Standard; Pin Count: 2; Value: 120R@100MHz; Manufacturer Part Number: BLM18SG121TN1D; Case: 0603; Mounted: Yes; Socket: No; SMD: Yes; Sense: No; ComponentHeight: 0.65mm; HelpURL: \\cern.ch\dfs\Applications\Altium\Datasheets\IND0603_MURATA_BLM18S.pdf; Author: CERN DEM JLC; CreateDate: 7/23/2014; LatestRevisionDate: 10/25/2018
L16 = IND_1UH_20%_COILCRAFT_PFL3215: Inductor With Core; Part Description: SMD Shielded Power Inductor; Manufacturer Part Number: PFL3215-102MEB; Power: 1.9A; Resistance: 0.038R; Tolerance: ±20%; Part Number: IND_1UH_20%_COILCRAFT_PFL3215; Component Kind: Standard; Component Type: Standard; Pin Count: 2; Value: 1uH; Manufacturer: COILCRAFT; Mounted: Yes; Socket: No; SMD: Yes; Sense: No; ComponentHeight: 1.5mm; HelpURL: \\cern.ch\dfs\Applications\Altium\Datasheets\IND_COILCRAFT_PFL3215.pdf; Author: CERN DEM MR; CreateDate: 3/14/2016; LatestRevisionDate: 3/14/2016
LD1-LD7 = LED_AVAGO_HSME-C120: LED Green 1C 2A; Part Description: High Performance Right Angle Chip Green LED; Manufacturer: AVAGO TECHNOLOGIES; PressFit: No; Bonding: No; Part Number: LED_AVAGO_HSME-C120; Component Kind: Standard; Component Type: Standard; Color: Green; PackageDescription: Green Chip LED, 2-Leads, Body 1.7x1.1mm, Side Emitting Package; Manufacturer Part Number: HSME-C120; Pin Count: 2; Mounted: Yes; Socket: No; SMD: Yes; Sense: No; ComponentHeight: 0.7mm; HelpURL: \\cern.ch\dfs\Applications\Altium\Datasheets\LED_AVAGO_HSME-C120.pdf; ComponentLink1URL: \\cern.ch\dfs\Applications\Altium\Datasheets\LED_AVAGO_HSME-C110_DESIGN-GUIDE.pdf; ComponentLink1Description: Design Guide; Author: CERN DEM JMW; CreateDate: 22.07.2009; LatestRevisionDate: 20.06.2012
R59 R68 = R0603_147K_0.1%_0.063W_10PPM: Resistor - 0.1%; Part Description: Thin Film Chip Resistor; Manufacturer: GENERIC; Manufacturer1 Part Number: RN73C1J147KBTDF; Power: 0.063W; TC: ±10ppm; PressFit: No; Part Number: R0603_147K_0.1%_0.063W_10PPM; Component Kind: Standard; Component Type: Standard; Pin Count: 2; Value: 147k; Status: Not Recommended; Manufacturer Part Number: R0603_147K_0.1%_0.063W_10PPM; Case: 0603; Mounted: Yes; Sense: No; Socket: No; SMD: Yes; Manufacturer1 Example: TYCO HOLSWORTHY; Manufacturer1 ComponentHeight: 0.5mm; HelpURL: \\cern.ch\dfs\Applications\Altium\Datasheets\R0603_Tyco_RN73.pdf; Author: CERN DEM JLC; CreateDate: 12/3/2007; LatestRevisionDate: 3/13/2008
R60 = R0402_1K5_1%_0.0625W_100PPM: Resistor - 1%; Part Description: General Purpose Thick Film Chip Resistor; Manufacturer: GENERIC; Manufacturer1 Part Number: 232270671502L; TC: ±100ppm/°C; PressFit: No; Part Number: R0402_1K5_1%_0.0625W_100PPM; Component Kind: Standard; Component Type: Standard; Pin Count: 2; Value: 1k5; Status: Not Recommended; Power: 0.0625W; Manufacturer Part Number: R0402_1K5_1%_0.0625W_100PPM; Case: 0402; Mounted: Yes; Sense: No; Socket: No; SMD: Yes; Manufacturer1 Example: YAGEO PHYCOMP; Manufacturer1 ComponentHeight: 0.4mm; HelpURL: \\cern.ch\dfs\Applications\Altium\Datasheets\R0402_Phycomp_RC0402.pdf; Author: CERN DEM JLC; CreateDate: 12/3/2007; LatestRevisionDate: 10/17/2012
R61 R74 R78 R81 R85 R90 R92 R95 = R0402_33K_1%_0.0625W_100PPM: Resistor - 1%; Part Description: General Purpose Thick Film Chip Resistor; Manufacturer: GENERIC; Manufacturer1 Part Number: 232270673303L; TC: ±100ppm/°C; PressFit: No; Part Number: R0402_33K_1%_0.0625W_100PPM; Component Kind: Standard; Component Type: Standard; Pin Count: 2; Value: 33k; Status: Not Recommended; Power: 0.0625W; Manufacturer Part Number: R0402_33K_1%_0.0625W_100PPM; Case: 0402; Mounted: Yes; Sense: No; Socket: No; SMD: Yes; Manufacturer1 Example: YAGEO PHYCOMP; Manufacturer1 ComponentHeight: 0.4mm; HelpURL: \\cern.ch\dfs\Applications\Altium\Datasheets\R0402_Phycomp_RC0402.pdf; Author: CERN DEM JLC; CreateDate: 12/3/2007; LatestRevisionDate: 10/17/2012
R62 R63 = R0402_100K_1%_0.0625W_100PPM: Resistor - 1%; Part Description: General Purpose Thick Film Chip Resistor; Manufacturer: GENERIC; Manufacturer1 Part Number: 232270671004L; TC: ±100ppm/°C; PressFit: No; Part Number: R0402_100K_1%_0.0625W_100PPM; Component Kind: Standard; Component Type: Standard; Pin Count: 2; Value: 100k; Status: Not Recommended; Power: 0.0625W; Manufacturer Part Number: R0402_100K_1%_0.0625W_100PPM; Case: 0402; Mounted: Yes; Sense: No; Socket: No; SMD: Yes; Manufacturer1 Example: YAGEO PHYCOMP; Manufacturer1 ComponentHeight: 0.4mm; HelpURL: \\cern.ch\dfs\Applications\Altium\Datasheets\R0402_Phycomp_RC0402.pdf; Author: CERN DEM JLC; CreateDate: 12/3/2007; LatestRevisionDate: 10/17/2012
R64 = R0603_500R_1%_0.1W_100PPM: Resistor - 1%; Part Description: General Purpose Thick Film Chip Resistor; Manufacturer: GENERIC; Manufacturer1 Part Number: CRCW0603500RFKEA; Power: 0.1W; TC: ±100ppm/°C; PressFit: No; Part Number: R0603_500R_1%_0.1W_100PPM; Component Kind: Standard; Component Type: Standard; Pin Count: 2; Value: 500; Status: Preferred; Manufacturer Part Number: R0603_500R_1%_0.1W_100PPM; Case: 0603; Mounted: Yes; Sense: No; Socket: No; SMD: Yes; Manufacturer1 Example: VISHAY; Manufacturer1 ComponentHeight: 0.50mm; HelpURL: \\cern.ch\dfs\Applications\Altium\Datasheets\R0603_VISHAY_CRCW e3.pdf; Author: CERN DEM JLC; CreateDate: 3/21/2018; LatestRevisionDate: 3/21/2018
R65 R73 = R0402_2K2_1%_0.0625W_100PPM: Resistor - 1%; Part Description: General Purpose Thick Film Chip Resistor; Manufacturer: GENERIC; Manufacturer1 Part Number: 232270672202L; TC: ±100ppm/°C; PressFit: No; Part Number: R0402_2K2_1%_0.0625W_100PPM; Component Kind: Standard; Component Type: Standard; Pin Count: 2; Value: 2k2; Status: Not Recommended; Power: 0.0625W; Manufacturer Part Number: R0402_2K2_1%_0.0625W_100PPM; Case: 0402; Mounted: Yes; Sense: No; Socket: No; SMD: Yes; Manufacturer1 Example: YAGEO PHYCOMP; Manufacturer1 ComponentHeight: 0.4mm; HelpURL: \\cern.ch\dfs\Applications\Altium\Datasheets\R0402_Phycomp_RC0402.pdf; Author: CERN DEM JLC; CreateDate: 12/3/2007; LatestRevisionDate: 10/17/2012
R66 = R0402_1M_1%_0.0625W_100PPM: Resistor - 1%; Part Description: General Purpose Thick Film Chip Resistor; Manufacturer: GENERIC; Manufacturer1 Part Number: 232270671005L; TC: ±100ppm/°C; PressFit: No; Part Number: R0402_1M_1%_0.0625W_100PPM; Component Kind: Standard; Component Type: Standard; Pin Count: 2; Value: 1M; Status: Not Recommended; Power: 0.0625W; Manufacturer Part Number: R0402_1M_1%_0.0625W_100PPM; Case: 0402; Mounted: Yes; Sense: No; Socket: No; SMD: Yes; Manufacturer1 Example: YAGEO PHYCOMP; Manufacturer1 ComponentHeight: 0.4mm; HelpURL: \\cern.ch\dfs\Applications\Altium\Datasheets\R0402_Phycomp_RC0402.pdf; Author: CERN DEM JLC; CreateDate: 12/3/2007; LatestRevisionDate: 10/17/2012
R67 = R0402_36K_1%_0.0625W_100PPM: Resistor - 1%; Part Description: General Purpose Thick Film Chip Resistor; Manufacturer: GENERIC; Manufacturer1 Part Number: 232270673603L; TC: ±100ppm/°C; PressFit: No; Part Number: R0402_36K_1%_0.0625W_100PPM; Component Kind: Standard; Component Type: Standard; Pin Count: 2; Value: 36k; Status: Not Recommended; Power: 0.0625W; Manufacturer Part Number: R0402_36K_1%_0.0625W_100PPM; Case: 0402; Mounted: Yes; Sense: No; Socket: No; SMD: Yes; Manufacturer1 Example: YAGEO PHYCOMP; Manufacturer1 ComponentHeight: 0.4mm; HelpURL: \\cern.ch\dfs\Applications\Altium\Datasheets\R0402_Phycomp_RC0402.pdf; Author: CERN DEM JLC; CreateDate: 12/3/2007; LatestRevisionDate: 10/17/2012
R69 = R0402_160K_1%_0.0625W_100PPM: Resistor - 1%; Part Description: General Purpose Thick Film Chip Resistor; Manufacturer: GENERIC; Manufacturer1 Part Number: 232270671604L; TC: ±100ppm/°C; PressFit: No; Part Number: R0402_160K_1%_0.0625W_100PPM; Component Kind: Standard; Component Type: Standard; Pin Count: 2; Value: 160k; Status: Not Recommended; Power: 0.0625W; Manufacturer Part Number: R0402_160K_1%_0.0625W_100PPM; Case: 0402; Mounted: Yes; Sense: No; Socket: No; SMD: Yes; Manufacturer1 Example: YAGEO PHYCOMP; Manufacturer1 ComponentHeight: 0.4mm; HelpURL: \\cern.ch\dfs\Applications\Altium\Datasheets\R0402_Phycomp_RC0402.pdf; Author: CERN DEM JLC; CreateDate: 12/3/2007; LatestRevisionDate: 10/17/2012
R70 = R0603_18K2_0.1%_0.063W_10PPM: Resistor - 0.1%; Part Description: Thin Film Chip Resistor; Manufacturer: GENERIC; Manufacturer1 Part Number: RN73C1J18K2BTDF; Power: 0.063W; TC: ±10ppm; PressFit: No; Part Number: R0603_18K2_0.1%_0.063W_10PPM; Component Kind: Standard; Component Type: Standard; Pin Count: 2; Value: 18k2; Status: Not Recommended; Manufacturer Part Number: R0603_18K2_0.1%_0.063W_10PPM; Case: 0603; Mounted: Yes; Sense: No; Socket: No; SMD: Yes; Manufacturer1 Example: TYCO HOLSWORTHY; Manufacturer1 ComponentHeight: 0.5mm; HelpURL: \\cern.ch\dfs\Applications\Altium\Datasheets\R0603_Tyco_RN73.pdf; Author: CERN DEM JLC; CreateDate: 12/3/2007; LatestRevisionDate: 3/13/2008
R71 R72 R75-R77 R79 R80 = R0402_10K_1%_0.0625W_100PPM: Resistor - 1%; Part Description: General Purpose Thick Film Chip Resistor; Manufacturer: GENERIC; Manufacturer1 Part Number: 232270671003L; TC: ±100ppm/°C; PressFit: No; Part Number: R0402_10K_1%_0.0625W_100PPM; Component Kind: Standard; Component Type: Standard; Pin Count: 2; Value: 10k; Status: Not Recommended; Power: 0.0625W; Manufacturer Part Number: R0402_10K_1%_0.0625W_100PPM; Case: 0402; Mounted: Yes; Sense: No; Socket: No; SMD: Yes; Manufacturer1 Example: YAGEO PHYCOMP; Manufacturer1 ComponentHeight: 0.4mm; HelpURL: \\cern.ch\dfs\Applications\Altium\Datasheets\R0402_Phycomp_RC0402.pdf; Author: CERN DEM JLC; CreateDate: 12/3/2007; LatestRevisionDate: 10/17/2012
R82 R83 R87 R88 R93 R94 R97 R98 = R0402_3K_1%_0.0625W_100PPM: Resistor - 1%; Part Description: General Purpose Thick Film Chip Resistor; Manufacturer: GENERIC; Manufacturer1 Part Number: 232270673002L; TC: ±100ppm/°C; PressFit: No; Part Number: R0402_3K_1%_0.0625W_100PPM; Component Kind: Standard; Component Type: Standard; Pin Count: 2; Value: 3k; Status: Not Recommended; Power: 0.0625W; Manufacturer Part Number: R0402_3K_1%_0.0625W_100PPM; Case: 0402; Mounted: Yes; Sense: No; Socket: No; SMD: Yes; Manufacturer1 Example: YAGEO PHYCOMP; Manufacturer1 ComponentHeight: 0.4mm; HelpURL: \\cern.ch\dfs\Applications\Altium\Datasheets\R0402_Phycomp_RC0402.pdf; Author: CERN DEM JLC; CreateDate: 12/3/2007; LatestRevisionDate: 10/17/2012
R84 R99 R125-R131 = R0402_499R_1%_0.1W_100PPM: Resistor - 1%; Part Description: General Purpose Thick Film Chip Resistor; Manufacturer: GENERIC; Manufacturer1 Part Number: ERJ2RKF4990X; Power: 0.1W; TC: ±100ppm/°C; Voltage: 50V; PressFit: No; Part Number: R0402_499R_1%_0.1W_100PPM; Component Kind: Standard; Component Type: Standard; Pin Count: 2; Value: 499; Status: Not Recommended; Manufacturer Part Number: R0402_499R_1%_0.1W_100PPM; Case: 0402; Mounted: Yes; Sense: No; Socket: No; SMD: Yes; Manufacturer1 Example: PANASONIC; Manufacturer1 ComponentHeight: 0.4mm; HelpURL: \\cern.ch\dfs\Applications\Altium\Datasheets\R0402_PANASONIC_ERJ2RK.pdf; Author: CERN DEM MR; CreateDate: 11/22/2016; LatestRevisionDate: 11/22/2016
R86 R89 R91 R96 = R0402_11K_1%_0.0625W_100PPM: Resistor - 1%; Part Description: General Purpose Thick Film Chip Resistor; Manufacturer: GENERIC; Manufacturer1 Part Number: 232270671103L; TC: ±100ppm/°C; PressFit: No; Part Number: R0402_11K_1%_0.0625W_100PPM; Component Kind: Standard; Component Type: Standard; Pin Count: 2; Value: 11k; Status: Not Recommended; Power: 0.0625W; Manufacturer Part Number: R0402_11K_1%_0.0625W_100PPM; Case: 0402; Mounted: Yes; Sense: No; Socket: No; SMD: Yes; Manufacturer1 Example: YAGEO PHYCOMP; Manufacturer1 ComponentHeight: 0.4mm; HelpURL: \\cern.ch\dfs\Applications\Altium\Datasheets\R0402_Phycomp_RC0402.pdf; Author: CERN DEM JLC; CreateDate: 12/3/2007; LatestRevisionDate: 10/17/2012
T5 T6 T8-T14 = BSS138LT1G: N-CHANNEL MOSFET WITH DIODE; Part Description: 50V 200mA N-Channel Enhancement Mode Field-Effect Transistor; Manufacturer: ON SEMICONDUCTOR; PressFit: No; Bonding: No; Part Number: BSS138LT1G; Component Kind: Standard; Component Type: Standard; Device: BSS138LT1G; PackageDescription: SOT23 3-Leads, Pitch 0.95mm - Body 1.4x3mm, IPC Medium Density; Manufacturer Part Number: BSS138LT1G; Pin Count: 3; Case: SOT23-3; Mounted: Yes; Socket: No; SMD: Yes; Sense: No; ComponentHeight: 1.11mm; HelpURL: \\cern.ch\dfs\Applications\Altium\Datasheets\BSS138LT1G.pdf; Author: CERN DEM JLC; CreateDate: 23.03.2009; LatestRevisionDate: 23.03.2009